# EAGLE design attiny85-mini-mk-2.1 (EAGLE 6.5.0)
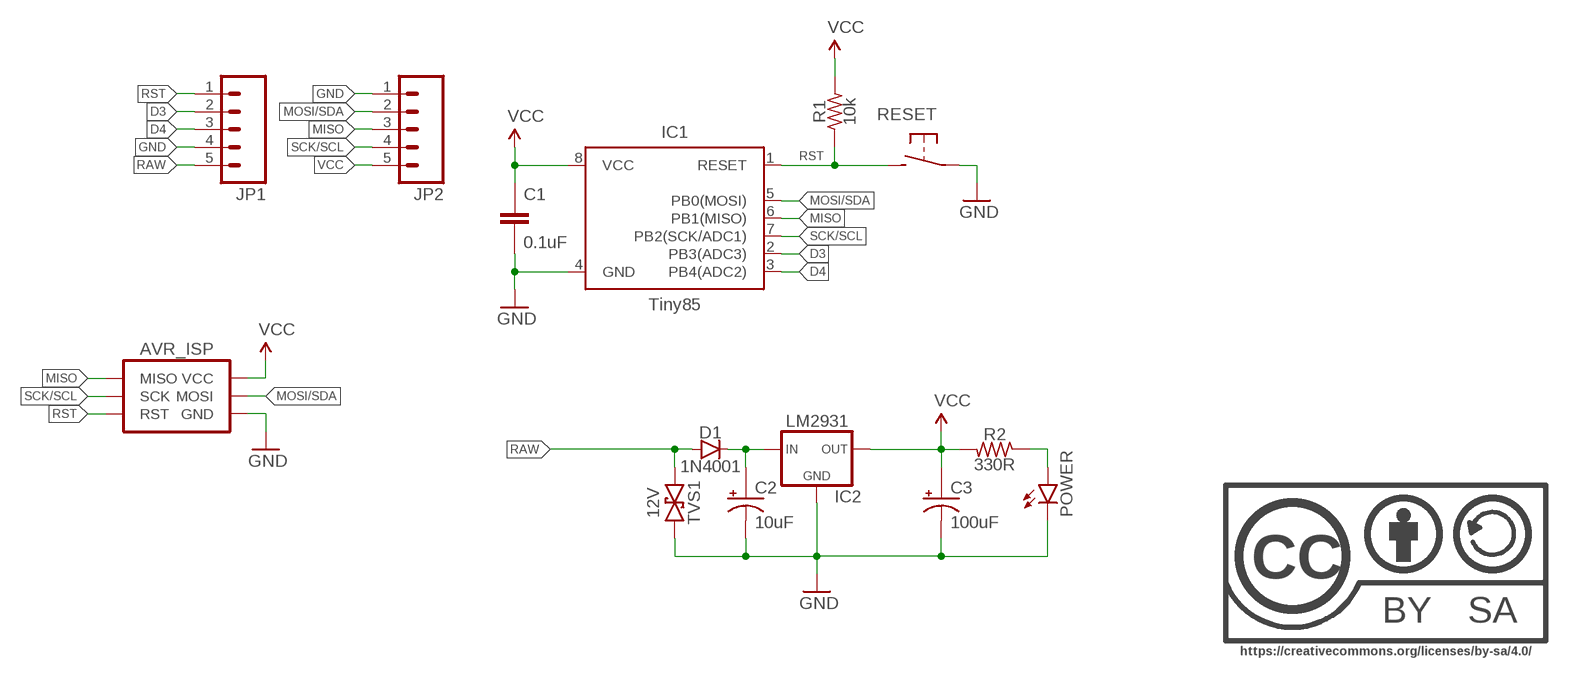
[diagram p0: schematic, sheet 1]

## Parts
AVR_ISP  AVR_SPI_PRG_6PTH  [2X3]
C1  0.1uF  CAPACITOR-CERAMIC025-024X044  [C025-024X044]
C2  10uF  CAPACITOR-POLARIZEDE2.5-5  [E2,5-5]
C3  100uF  CAPACITOR-POLARIZEDE2.5-5  [E2,5-5]
D1  1N4001  DIODEPTH-10.68MM  [DIODE-10.16MM]
IC1  Tiny85  ATTINY45TINY85-20-DIP  [DIP08]
IC2  LM2931  V_REG_78XXTO-92-INLINE  [TO-92-AMMO]
JP1  M05PTH  [1X05]
JP2  M05PTH  [1X05]
POWER  LED3MM-LESS  [LED3MM-LESSSILK]
R1  10k  RESISTORPTH-AXIAL-7.62MM  [RESISTOR-AXIAL-PTH-7.62MM]
R2  330R  RESISTORPTH-AXIAL-7.62MM  [RESISTOR-AXIAL-PTH-7.62MM]
RESET  DTS-6MM  SPST-NO-TACT3MM-PTH-SMALL-PADS  [DTS-3-SMALL-PADS]
TVS1  12V  TVSDO-41-TVS-BIDIRECTIONAL  [DO-41-TVS]
U$1  CC-BY-SA-4.0NO-URL  [CC-BY-SA-4.0-NO-URL]

## Nets
D3: IC1.2(PB3(ADC3)) JP1.2
D4: IC1.3(PB4(ADC2)) JP1.3
GND: AVR_ISP.6(GND) C1.2 C2.- C3.- IC1.4(GND) IC2.2(GND) JP1.4 JP2.1 POWER.K(C) RESET.1 TVS1.P$2
MISO: AVR_ISP.1(MISO) IC1.6(PB1(MISO)) JP2.3
MOSI/SDA: AVR_ISP.4(MOSI) IC1.5(PB0(MOSI)) JP2.2
N$3: C2.+ D1.C IC2.1(IN)
N$7: POWER.A R2.P$1
RAW: D1.A JP1.5 TVS1.P$1
RST: AVR_ISP.5(RST) IC1.1(RESET) JP1.1 R1.P$1 RESET.2
SCK/SCL: AVR_ISP.3(SCK) IC1.7(PB2(SCK/ADC1)) JP2.4
VCC: AVR_ISP.2(VCC) C1.1 C3.+ IC1.8(VCC) IC2.3(OUT) JP2.5 R1.P$2 R2.P$2

## Library data of the parts
AVR_ISP = A_butts:AVR_SPI_PRG_6: AVR ISP 6 Pin This is the reduced ISP connector for AVR programming. Common on Arduino. This footprint will take up less PCB space and can be used with a 10-pin to 6-pin adapter such as SKU: BOB-08508 **Special note about "TEST_POINT" package. The stop mask is on the top side, so if you want your programming test points to be on the bottom of your board, make sure to place this package on the bottom side of the board. This also ensure that the orientation to program from the bottom side will be correct.
C1 = A_butts:CAPACITOR-CERAMIC: CAPACITOR, European symbol
C2 C3 = A_butts:CAPACITOR-POLARIZED: POLARIZED CAPACITOR, American symbol
D1 = A_butts:DIODE: Diode These are standard reverse protection diodes and small signal diodes. SMA package can handle up to about 1A. SOD-323 can handle about 200mA. What the SOD-323 package when ordering, there are some mfgs out there that are 5-pin packages.
IC1 = A_butts:ATTINY45: Atmel 8-pin 2/4/8kB flash uC; PROD_ID: IC-09445; VALUE: TINY85-20-DIP
IC2 = A_butts:V_REG_78XX: Voltage Regulator Standard 7805 5V regulator. IGO (Input Ground Output). Spark Fun Electronics SKU : COM-00107
JP1 JP2 = A_butts:M05: Header 5 Standard 5-pin 0.1" header. Use with straight break away headers (SKU : PRT-00116), right angle break away headers (PRT-00553), swiss pins (PRT-00743), machine pins (PRT-00117), and female headers (PRT-00115). Molex polarized connector foot print use with SKU : PRT-08230 with associated crimp pins and housings.
POWER = A_butts:LED: LEDs Standard schematic elements and footprints for 5mm, 3mm, 1206, and 0603 sized LEDs. 5mm - Spark Fun Electronics SKU : COM-00529 (and others)
R1 R2 = A_butts:RESISTOR: RESISTOR, American symbol
RESET = A_butts:SPST-NO-TACT
TVS1 = A_butts:TVS: Transient voltage suppressor- prevents ESD on inputs. Ignore package description- MBRA140 is NOT this type of part!!!
U$1 = A_butts:CC-BY-SA-4.0

## Board
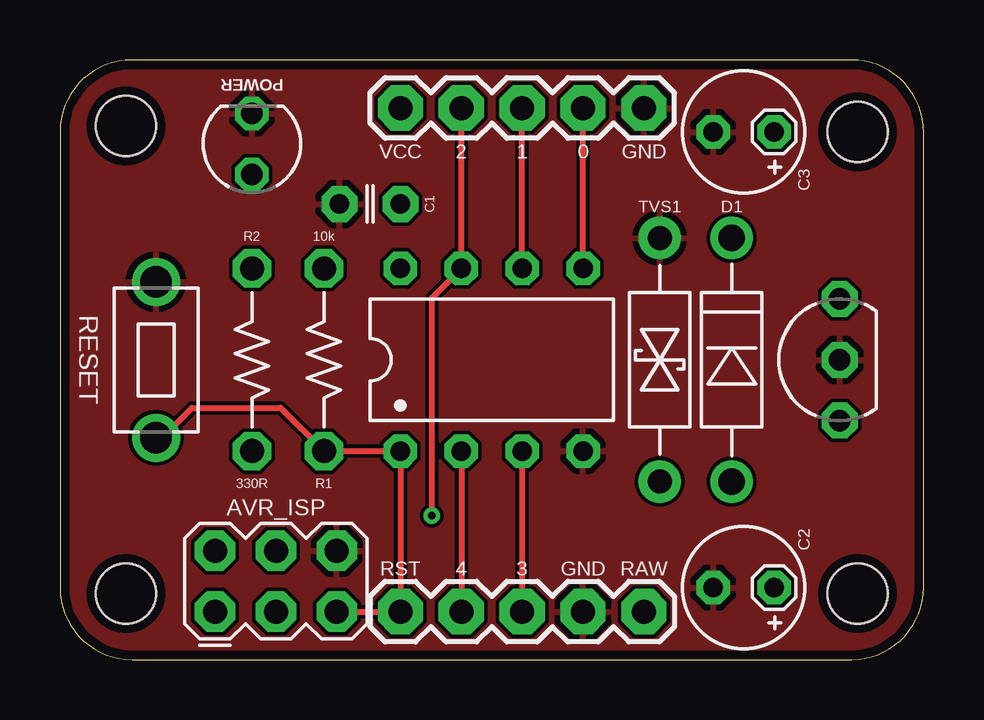
[diagram p1: board, top side]
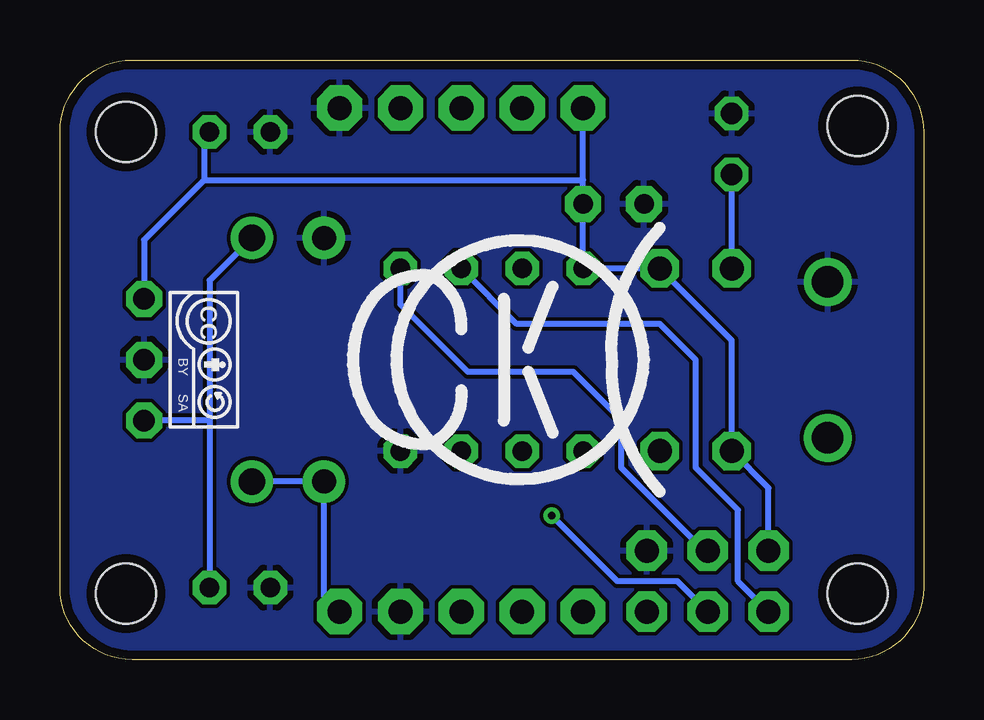
[diagram p2: board, bottom side, seen from below]

Size 36 x 25 mm. Coordinates in mm from the lower left corner, seen from the top.
Outline: 0,22 0,3 arc90 3,0 33,0 arc90 36,3 36,22 arc90 33,25 3,25 arc90 0,22
Copper layers (1*16): Top 0.0356mm / dielectric 1.5011mm / Bottom 0.0356mm
Design rules "LaenPCBOrder2": minimum track width 6mil, minimum drill 13mil, track to track 6mil, track to pad 6mil, pad to pad 6mil, via to via 6mil, smd to smd 6mil, copper to edge 15mil, drill to drill 6mil, minimum pad ring 7mil, minimum via ring 7mil, stop-mask expansion 3mil, vias tented up to drill 20mil, thermal gap 10mil
Holes 2.5 mm at 2.75,2.75 33.25,2.75 33.25,22 2.75,22.25

### Footprints (pad centres in the part's own frame; a part is rotated, then mirrored left to right if it is on the bottom)
2X3 = drill 1 pad 1.676 octagon: 1 -2.54,-1.27; 2 -2.54,1.27; 3 0,-1.27; 4 0,1.27; 5 2.54,-1.27; 6 2.54,1.27
C025-024X044 = drill 0.813 pad 1.5 octagon: 1 -1.27,0; 2 1.27,0
E2,5-5 = drill 0.8 pad 1.4 octagon: + -1.27,0; - 1.27,0
DIODE-10.16MM = drill 1.1 pad 1.778: A -5.08,0; C 5.08,0
DIP08 = drill 0.8 pad 1.4 octagon: 1 -3.81,-3.81; 2 -1.27,-3.81; 3 1.27,-3.81; 4 3.81,-3.81; 5 3.81,3.81; 6 1.27,3.81; 7 -1.27,3.81; 8 -3.81,3.81
TO-92-AMMO = drill 0.9 pad 1.5 octagon: 1 -2.54,0; 2 0,0; 3 2.54,0
1X05 = drill 1 pad 1.88 octagon: 1 0,0; 2 2.54,0; 3 5.08,0; 4 7.62,0; 5 10.16,0
LED3MM-LESSSILK = drill 0.9 pad 1.4 octagon: A -1.27,0; K 1.27,0
RESISTOR-AXIAL-PTH-7.62MM = drill 1 pad 1.6 octagon: P$1 -3.81,0; P$2 3.81,0
DTS-3-SMALL-PADS = drill 1.3 pad 2: 1 -3.25,0; 2 3.25,0
DO-41-TVS = drill 1 pad 1.778: P$1 -5.08,0; P$2 5.08,0

### Placement (x,y rotation side)
AVR_ISP  9,3.27 0 top
C1  12.92,19 180 top
C2  28.5,3 180 top
C3  28.5,22 180 top
D1  28,12.5 90 top
IC1  18,12.5 0 top
IC2  32.5,12.5 90 top
JP1  14.19,2 0 top
JP2  24.35,23 180 top
POWER  8,21.5 90 top
R1  11,12.5 90 top
R2  8,12.5 270 top
RESET  4,12.5 270 top
TVS1  25,12.5 90 top
U$1  30,12.5 270 bottom
U$2  [COW]  18,12.5 270 bottom

### Tracks (layer width: path | path; a pad name or v marks a point on that pad's centre or on a via)
D3
  Top 0.25: IC1.2 JP1.2
D4
  Top 0.25: IC1.3 JP1.3
GND
  pour Top: 36.1,25.1 36.1,-0.1 -0.1,-0.1 -0.1,25.1
  pour Bottom: 36.1,25.1 36.1,-0.1 -0.1,-0.1 -0.1,25.1
MISO
  Top 0.25: IC1.6 JP2.3
  Bottom 0.25: AVR_ISP.1 7.73,3.27 7.73,6.23 9.5,8 9.5,12.5 11,14 16.96,14 IC1.6
MOSI/SDA
  Top 0.25: IC1.5 JP2.2
  Bottom 0.25: AVR_ISP.4 9.14,4.54 12.6,8 12.6,10 14.6,12 19,12 21.81,14.81 IC1.5
N$3
  Bottom 0.25: D1.C 29.77,15.81 29.77,10 | 29.77,10 C2.+ | IC2.1 32.46,10 29.77,10
N$7
  Bottom 0.25: R2.P$1 POWER.A
RAW
  Bottom 0.25: JP1.5 25,2.65 TVS1.P$1 D1.A
RST
  Top 0.25: AVR_ISP.5 JP1.1 IC1.1 R1.P$1 9.19,10.5 5.5,10.5 4.25,9.25 RESET.2
SCK/SCL  (via drill 0.33)
  Top 0.25: JP2.4 IC1.7 15.5,15.08 v15.5,6
  Bottom 0.25: AVR_ISP.3 10.27,3.27 12.77,3.27 v15.5,6
VCC
  Bottom 0.25: 14.19,20 C1.1 IC1.8 R1.P$2 8,13.31 R2.P$2 6.46,7.15 AVR_ISP.2 | 14.19,20 JP2.5 | 30,20 14.19,20 | 30,20 32.5,17.5 IC2.3 | C3.+ 30,21.77 30,20

### Text on the board
tPlace: VCC | 2 | 1 | 0 | GND | RST | 4 | 3 | GND | RAW